# Altium schematic sheet USART&IrDA.SchDoc
size A4; Revision: B.2(PCB.SCH)
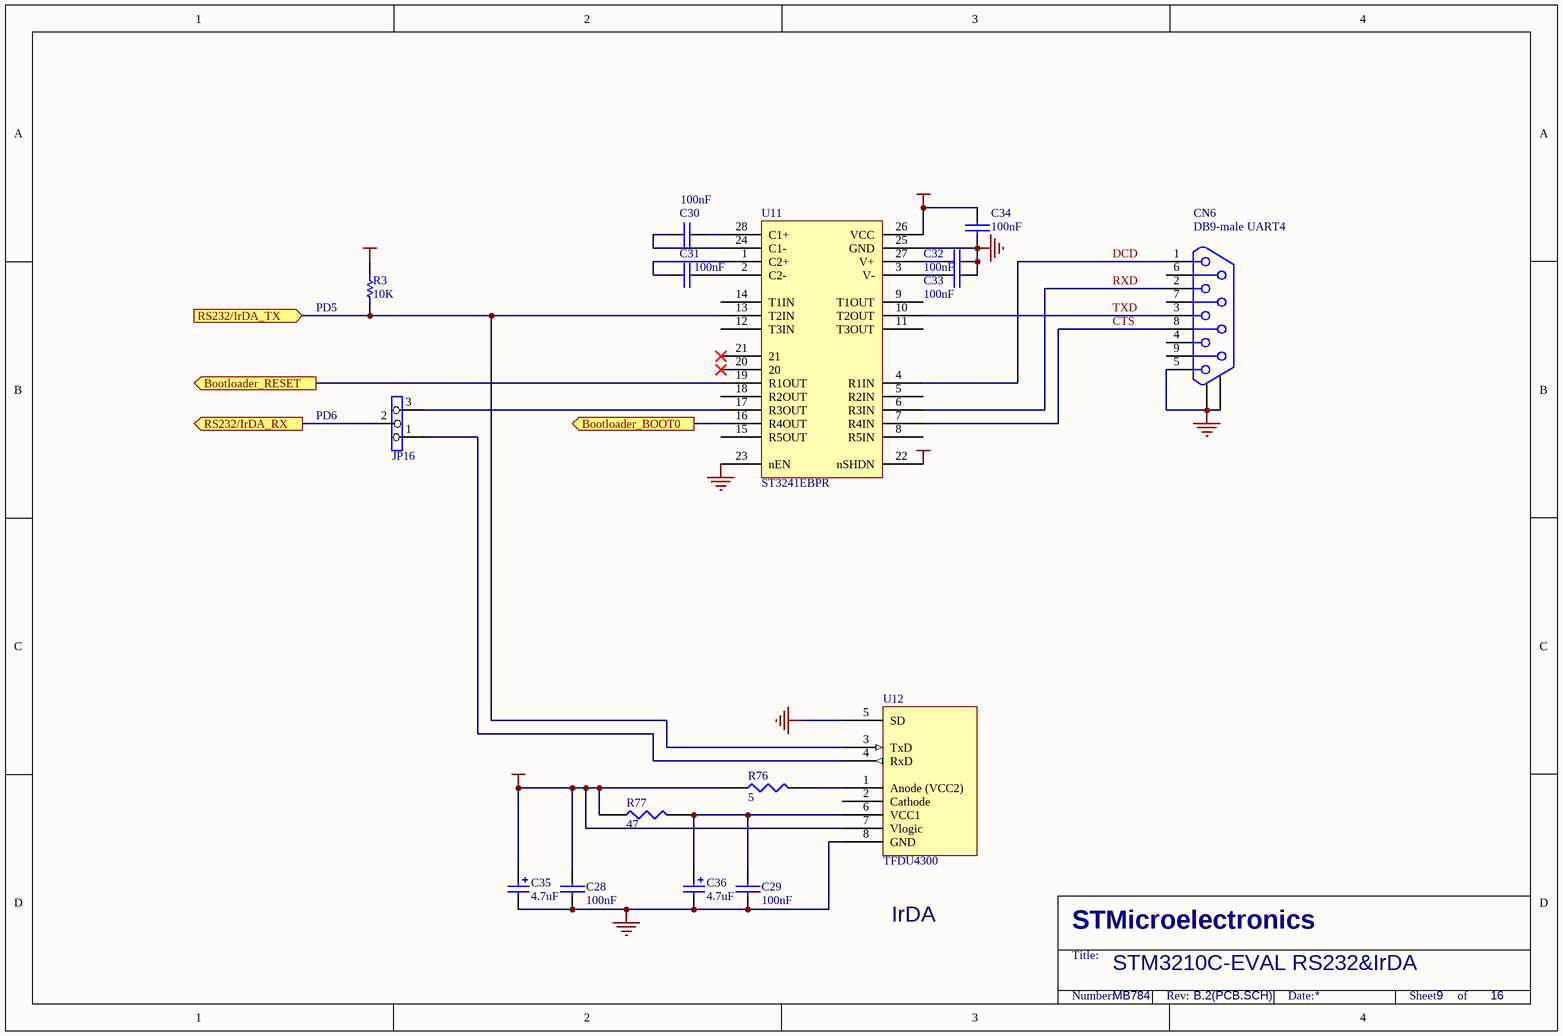
[diagram p0: USART&IrDA.SchDoc]

## Parts
C28  100nF  [0603C]
C29  100nF  [0603C]
C30  100nF  [0603C]
C31  100nF  [0603C]
C32  100nF  [0603C]
C33  100nF  [0603C]
C34  100nF  [0603C]
C35  4.7uF  [TAN-A]
C36  4.7uF  [TAN-A]
CN6  DB9-male UART4  [DB9/M]
JP16  (no value)  [SIP3]
R3  10K  [0603R]
R76  5  [0603R]
R77  47  [0603R]
U11  ST3241EBPR  [SSOP28]
U12  TFDU4300  [IR_VISHAY3]

## Ports
Bootloader_BOOT0 (out), Bootloader_RESET (out), RS232/IrDA_RX (out), RS232/IrDA_TX (in)

## Nets
+3V3: C28.1 C34.2 C35.1 R3.1 R76.1 R77.1 U11.22(nSHDN) U11.26(VCC) U12.7(Vlogic)
GND: C28.2 C29.2 C32.2 C33.2 C34.1 C35.2 C36.2 CN6.0 CN6.5 U11.23(nEN) U11.25(GND) U12.5(SD) U12.8(GND)
Bootloader_BOOT0: U11.16(R4OUT) ; port Bootloader_BOOT0
Bootloader_RESET: U11.19(R1OUT) ; port Bootloader_RESET
CTS: CN6.8 U11.7(R4IN)
DCD: CN6.1 U11.4(R1IN)
RS232/IrDA_RX: JP16.2 ; port RS232/IrDA_RX
RS232/IrDA_TX: R3.2 U11.13(T2IN) U12.3(TxD) ; port RS232/IrDA_TX
RXD: CN6.2 U11.6(R3IN)
TXD: CN6.3 U11.10(T2OUT)
NetC29_1: C29.1 C36.1 R77.2 U12.6(VCC1)
NetC30_1: C30.1 U11.24(C1-)
NetC30_2: C30.2 U11.28(C1+)
NetC31_1: C31.1 U11.1(C2+)
NetC31_2: C31.2 U11.2(C2-)
NetC32_1: C32.1 U11.27(V+)
NetC33_1: C33.1 U11.3(V-)
NetJP16_1: JP16.1 U12.4(RxD)
NetJP16_3: JP16.3 U11.17(R3OUT)
NetR76_2: R76.2 U12.1(Anode_(VCC2))

Not connected (* = marked no-connect by the designer): CN6 4 6 7 9; U11 5(R2IN) 8(R5IN) 9(T1OUT) 11(T3OUT) 12(T3IN) 14(T1IN) 15(R5OUT) 18(R2OUT) 20* 21*; U12 2(Cathode)

## Notes on the sheet
- (near R3) PD5
- PD6
- IrDA
- STM3210C-EVAL RS232&IrDA
- MB784
- 9
- 16
- STMicroelectronics
- Title:
- Number:
- Rev:
- Date:
- Sheet       of

## Library data of the parts
C28-C34 = CAP: Capacitor
C35 C36 = Cap Pol1: Polarized Capacitor (Radial); Value: 100pF; Published: 8-Jun-2000; Revision: July-2002: Re-released for DXP Platform.; Publisher: Altium Limited
CN6 = DB9
JP16 = Jumper3
R3 = Res1: Resistor; Value: 1K; Published: 8-Jun-2000; Revision: July-2002: Re-released for DXP Platform.; Publisher: Altium Limited
R76 R77 = RES1
U11 = ST3241